# Altium schematic sheet MSS_IO.SchDoc: uSDR schematic
size Letter; Author: Ye-sheng Kuo; CompanyName: Univ. of Michigan; Revision: 2.0; SheetNumber: 11; SheetTotal: 16
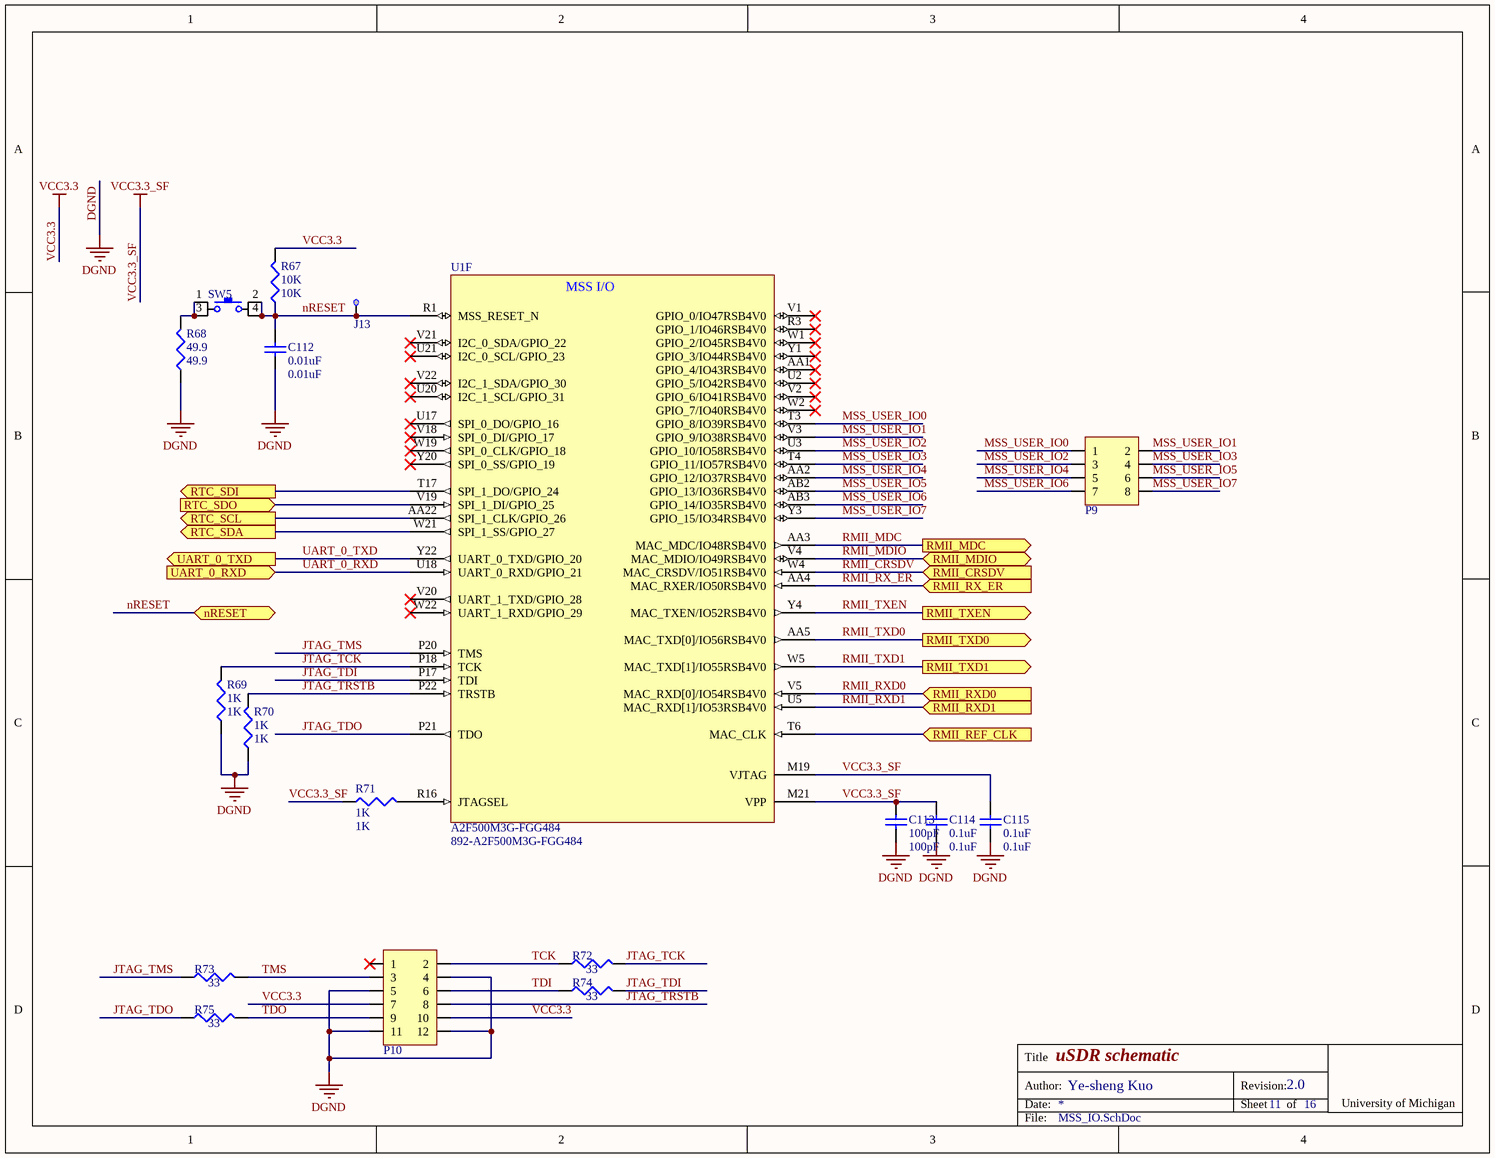
[diagram p0: MSS_IO.SchDoc]

## Parts
C112  0.01uF  [0402]
C113  100pF  [0402]
C114  0.1uF  [0402]
C115  0.1uF  [0402]
J13  5004  [TestPoint]  (value not drawn)
P9  2 x 4 header  [2x4 header]  (value not drawn)
P10  2 x 6 header  [2x6 header, right angle]  (value not drawn)
R67  10K  [0402]
R68  49.9  [0402]
R69  1K  [0402]
R70  1K  [0402]
R71  1K  [0402]
R72  33  [0402]
R73  33  [0402]
R74  33  [0402]
R75  33  [0402]
SW5  Switch 4-lead  [EVQPA PB]  (value not drawn)
U1  A2F500M3G-FGG484  Supplier Part Number 1: 892-A2F500M3G-FGG484  [BGA100P22X22-484N]  (part F of 13)

## Ports
nRESET (bidir), RMII_CRSDV (in), RMII_MDC (out), RMII_MDIO (bidir), RMII_REF_CLK (in), RMII_RX_ER (in), RMII_RXD0 (in), RMII_RXD1 (in), RMII_TXD0 (out), RMII_TXD1 (out), RMII_TXEN (out), RTC_SCL (out), RTC_SDA (out), RTC_SDI (out), RTC_SDO (in), UART_0_RXD (in), UART_0_TXD (out)

## Nets
DGND: C112.1 C113.1 C114.1 C115.1 P10.4 P10.5 P10.11 P10.12 R68.1 R69.1 R70.1
VCC3.3: P10.7 P10.10 R67.2
VCC3.3_SF: C113.2 C114.2 C115.2 R71.1 U1.M19(VJTAG) U1.M21(VPP)
JTAG_TCK: R69.2 R72.2 U1.P18(TCK)
JTAG_TDI: R74.2 U1.P17(TDI)
JTAG_TDO: R75.1 U1.P21(TDO)
JTAG_TMS: R73.1 U1.P20(TMS)
JTAG_TRSTB: P10.8 R70.2 U1.P22(TRSTB)
MSS_USER_IO0: P9.1 U1.T3(GPIO_8/IO39RSB4V0)
MSS_USER_IO1: P9.2 U1.V3(GPIO_9/IO38RSB4V0)
MSS_USER_IO2: P9.3 U1.U3(GPIO_10/IO58RSB4V0)
MSS_USER_IO3: P9.4 U1.T4(GPIO_11/IO57RSB4V0)
MSS_USER_IO4: P9.5 U1.AA2(GPIO_12/IO37RSB4V0)
MSS_USER_IO5: P9.6 U1.AB2(GPIO_13/IO36RSB4V0)
MSS_USER_IO6: P9.7 U1.AB3(GPIO_14/IO35RSB4V0)
MSS_USER_IO7: P9.8 U1.Y3(GPIO_15/IO34RSB4V0)
nRESET: C112.2 J13.1(TB) R67.1 SW5.2 SW5.4 U1.R1(MSS_RESET_N) ; port nRESET
RMII_CRSDV: U1.W4(MAC_CRSDV/IO51RSB4V0) ; port RMII_CRSDV
RMII_MDC: U1.AA3(MAC_MDC/IO48RSB4V0) ; port RMII_MDC
RMII_MDIO: U1.V4(MAC_MDIO/IO49RSB4V0) ; port RMII_MDIO
RMII_REF_CLK: U1.T6(MAC_CLK) ; port RMII_REF_CLK
RMII_RX_ER: U1.AA4(MAC_RXER/IO50RSB4V0) ; port RMII_RX_ER
RMII_RXD0: U1.V5(MAC_RXD[0]/IO54RSB4V0) ; port RMII_RXD0
RMII_RXD1: U1.U5(MAC_RXD[1]/IO53RSB4V0) ; port RMII_RXD1
RMII_TXD0: U1.AA5(MAC_TXD[0]/IO56RSB4V0) ; port RMII_TXD0
RMII_TXD1: U1.W5(MAC_TXD[1]/IO55RSB4V0) ; port RMII_TXD1
RMII_TXEN: U1.Y4(MAC_TXEN/IO52RSB4V0) ; port RMII_TXEN
RTC_SCL: U1.AA22(SPI_1_CLK/GPIO_26) ; port RTC_SCL
RTC_SDA: U1.W21(SPI_1_SS/GPIO_27) ; port RTC_SDA
RTC_SDI: U1.T17(SPI_1_DO/GPIO_24) ; port RTC_SDI
RTC_SDO: U1.V19(SPI_1_DI/GPIO_25) ; port RTC_SDO
TCK: P10.2 R72.1
TDI: P10.6 R74.1
TDO: P10.9 R75.2
TMS: P10.3 R73.2
UART_0_RXD: U1.U18(UART_0_RXD/GPIO_21) ; port UART_0_RXD
UART_0_TXD: U1.Y22(UART_0_TXD/GPIO_20) ; port UART_0_TXD
NetR68_2: R68.2 SW5.1 SW5.3
NetR71_2: R71.2 U1.R16(JTAGSEL)

Not connected (* = marked no-connect by the designer): P10 1*; U1 AA1(GPIO_4/IO43RSB4V0)* R3(GPIO_1/IO46RSB4V0)* U2(GPIO_5/IO42RSB4V0)* U17(SPI_0_DO/GPIO_16)* U20(I2C_1_SCL/GPIO_31)* U21(I2C_0_SCL/GPIO_23)* V1(GPIO_0/IO47RSB4V0)* V2(GPIO_6/IO41RSB4V0)* V18(SPI_0_DI/GPIO_17)* V20(UART_1_TXD/GPIO_28)* V21(I2C_0_SDA/GPIO_22)* V22(I2C_1_SDA/GPIO_30)* W1(GPIO_2/IO45RSB4V0)* W2(GPIO_7/IO40RSB4V0)* W19(SPI_0_CLK/GPIO_18)* W22(UART_1_RXD/GPIO_29)* Y1(GPIO_3/IO44RSB4V0)* Y20(SPI_0_SS/GPIO_19)*

## Notes on the sheet
- Title
- Date:
- Author:
- Revision:
- Sheet
- of
- University of Michigan
- File:
- (in symbol F2-200_500-FGG484_1, part F) MSS I/O

## Library data of the parts
C112-C115 = Cap Semi: Capacitor (Semiconductor SIM Model); Published: 8-Jun-2000; LatestRevisionDate: 29-May-2009; LatestRevisionNote: IPC-7351 Footprint Added.; PackageReference: C1206; Publisher: Altium Limited; PackageDescription: Chip Capacitor
  C112: Value: 0.01uF
  C113: Value: 100pF
  C114 C115: Value: 0.1uF
J13 = TestPoint: TEST POINT PC MINI .040"D YELLOW; Supplier 1: Digi-Key; Supplier Part Number 1: 5004K-ND; datasheet: http://mail.keyelco.com/ENG._DEPT/PDF%20CAT%20NO%20Drawings/5004.pdf
P9 = 2 x 4 header: 100 mils standard header; Supplier 1: Digi-Key; Supplier Part Number 1: 609-3226-ND
P10 = 2 x 6 header: 100 mils standard header; Supplier 1: Digi-Key; Supplier Part Number 1: 609-3345-ND
R67-R75 = Res3: Resistor; Published: 8-Jun-2000; LatestRevisionDate: 29-May-2009; LatestRevisionNote: IPC-7351 Footprint Added.; PackageReference: J1-0603; Publisher: Altium Limited; PackageDescription: Chip Resistor
  R67: Value: 10K
  R68: Value: 49.9
  R69-R71: Value: 1K
  R72-R75: Value: 33
SW5 = Switch 4-lead: Switch; Supplier 1: Digi-Key; Supplier Part Number 1: 401-1776-1-ND; Supplier 2: Digi-Key; Supplier Part Number 2: P8008S-ND
U1 = F2-200_500-FGG484_1: FPGA - Field Programmable Gate Array 500K System Gates; PPS#: P0934R; Supplier 1: Mouser